# EAGLE design THREE (EAGLE 8.3.2)
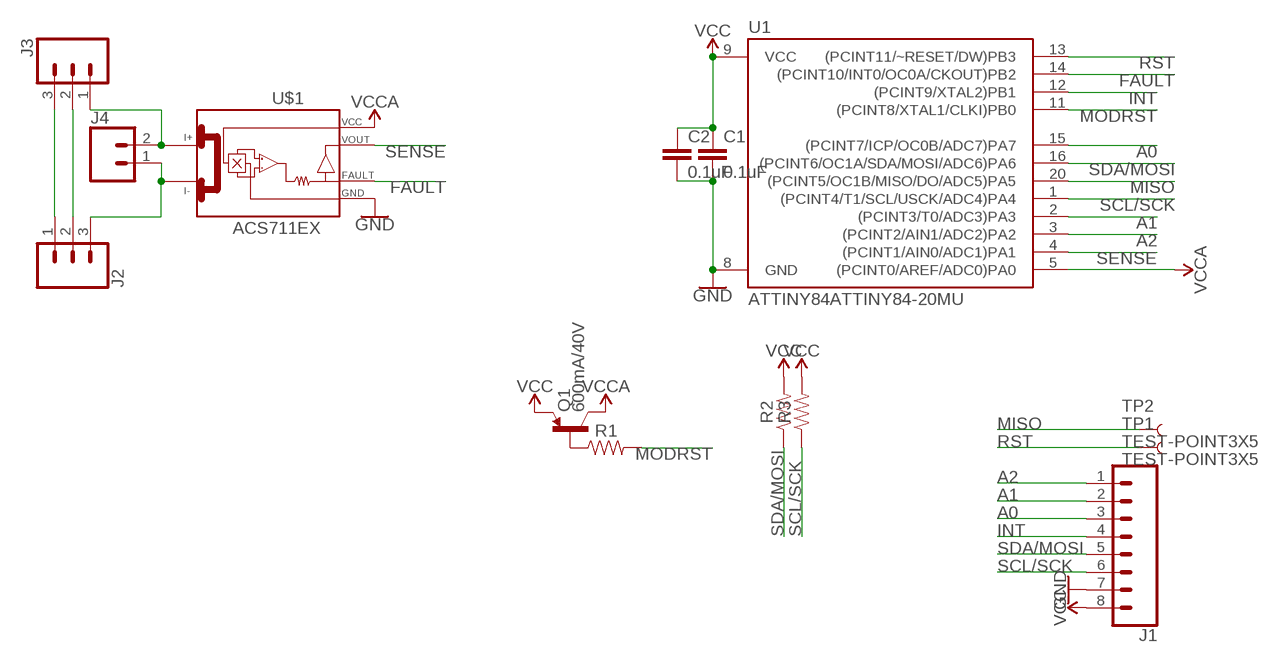
[diagram p0: schematic, sheet 1]

## Parts
C1  0.1uF  0.1UF-0603-25V-5%  [0603]
C2  0.1uF  0.1UF-0603-25V-5%  [0603]
J1  CONN_08NO_SILK_FEMALE_PTH  [1X08_NO_SILK]
J2  CONN_03-SCREW-5MM  [SCREWTERMINAL-5MM-3]
J3  CONN_03-SCREW-5MM  [SCREWTERMINAL-5MM-3]
J4  CONN_02  [1X02]
Q1  600mA/40V  TRANS_PNP-MMBT4403  [SOT23-3]
R1  RESISTOR0603  [0603]
R2  RESISTOR0603  [0603]
R3  RESISTOR0603  [0603]
TP1  TEST-POINT3X5  [PAD.03X.05]
TP2  TEST-POINT3X5  [PAD.03X.05]
U1  ATTINY84ATTINY84-20MU  [QFN20]
U$1  ACS711EX  [QFN-12EX_3X3]

## Nets
A0: J1.3 U1.15((PCINT7/ICP/OC0B/ADC7)PA7)
A1: J1.2 U1.2((PCINT3/T0/ADC3)PA3)
A2: J1.1 U1.3((PCINT2/AIN1/ADC2)PA2)
FAULT: U1.14((PCINT10/INT0/OC0A/CKOUT)PB2) U$1.P$4(FAULT)
GND: C1.2 C2.2 J1.7 U1.8(GND) U$1.P$3(GND)
INT: J1.4 U1.12((PCINT9/XTAL2)PB1)
MISO: TP2.P$1 U1.20((PCINT5/OC1B/MISO/DO/ADC5)PA5)
MODRST: R1.2 U1.11((PCINT8/XTAL1/CLKI)PB0)
N$1: J2.3 J4.1 U$1.P$2(I-_1)
N$2: J3.1 J4.2 U$1.P$1(I+_1)
N$3: J2.2 J3.2
N$4: Q1.1(B) R1.1
N$6: J2.1 J3.3
RST: TP1.P$1 U1.13((PCINT11/~RESET/DW)PB3)
SCL/SCK: J1.6 R3.1 U1.1((PCINT4/T1/SCL/USCK/ADC4)PA4)
SDA/MOSI: J1.5 R2.1 U1.16((PCINT6/OC1A/SDA/MOSI/ADC6)PA6)
SENSE: U1.4((PCINT1/AIN0/ADC1)PA1) U$1.P$9(VOUT)
VCC: C1.1 C2.1 J1.8 Q1.2(E) R2.2 R3.2 U1.9(VCC)
VCCA: Q1.3(C) U1.5((PCINT0/AREF/ADC0)PA0) U$1.P$10(VCC)

## Library data of the parts
C1 C2 = SparkFun-Capacitors:0.1UF: 0.1µF ceramic capacitors A capacitor is a passive two-terminal electrical component used to store electrical energy temporarily in an electric field.; PROD_ID: CAP-08604
J1 = SparkFun-Connectors:CONN_08: Multi connection point. Often used as Generic Header-pin footprint for 0.1 inch spaced/style header connections On any of the 0.1 inch spaced packages, you can populate with these: Break Away Headers - Straight <https://www.sparkfun.com/products/116> (PRT-00116) Break Away Male Headers - Right Angle <https://www.sparkfun.com/products/553> (PRT-00553) Female Headers <https://www.sparkfun.com/products/115> (PRT-00115) Break Away Headers - Machine Pin <https://www.sparkfun.com/products/117> (PRT-00117) Break Away Female Headers - Swiss Machine Pin <https://www.sparkfun.com/products/743> (PRT-00743) Arduino Stackable Header - 8 Pin <https://www.sparkfun.com/products/9279> (PRT-09279) For SCREWTERMINALS and SPRING TERMINALS visit here: Screw Terimnals on SparkFun.com <https://www.sparkfun.com/search/results?term=Screw+Terminals> (5mm/3.5mm/2.54mm spacing) This device is also useful as a general connection point to wire up your design to another part of your project. Our various solder wires solder well into these plated through hole pads. Hook-Up Wire - Assortment (Stranded, 22 AWG) <https://www.sparkfun.com/products/11375> (PRT-11375) Hook-Up Wire - Assortment (Solid Core, 22 AWG) <https://www.sparkfun.com/products/11367> (PRT-11367) View the entire wire category on our website here <https://www.sparkfun.com/categories/141> Special notes: Molex polarized connector foot print use with SKU : PRT-08231 with associated crimp pins and housings. 1MM SMD Version SKU: PRT-10208 NOTES ON THE VARIANTS LOCK and LOCK_LONGPADS... This footprint was designed to help hold the alignment of a through-hole component (i.e. 6-pin header) while soldering it into place. You may notice that each hole has been shifted either up or down by 0.005 of an inch from it's more standard position (which is a perfectly straight line). This slight alteration caused the pins (the squares in the middle) to touch the edges of the holes. Because they are alternating, it causes a "brace" to hold the component in place. 0.005 has proven to be the perfect amount of "off-center" position when using our standard breakaway headers. Although looks a little odd when you look at the bare footprint, once you have a header in there, the alteration is very hard to notice. Also,if you push a header all the way into place, it is covered up entirely on the bottom side.; PROD_ID: CONN-08438
J2 J3 = SparkFun-Connectors:CONN_03: Multi connection point. Often used as Generic Header-pin footprint for 0.1 inch spaced/style header connections On any of the 0.1 inch spaced packages, you can populate with these: Break Away Headers - Straight <https://www.sparkfun.com/products/116> (PRT-00116) Break Away Male Headers - Right Angle <https://www.sparkfun.com/products/553> (PRT-00553) Female Headers <https://www.sparkfun.com/products/115> (PRT-00115) Break Away Headers - Machine Pin <https://www.sparkfun.com/products/117> (PRT-00117) Break Away Female Headers - Swiss Machine Pin <https://www.sparkfun.com/products/743> (PRT-00743) Stackable Header - 3 Pin (Female, 0.1") <https://www.sparkfun.com/products/13875> (PRT-13875) For SCREWTERMINALS and SPRING TERMINALS visit here: Screw Terimnals on SparkFun.com <https://www.sparkfun.com/search/results?term=Screw+Terminals> (5mm/3.5mm/2.54mm spacing) This device is also useful as a general connection point to wire up your design to another part of your project. Our various solder wires solder well into these plated through hole pads. Hook-Up Wire - Assortment (Stranded, 22 AWG) <https://www.sparkfun.com/products/11375> (PRT-11375) Hook-Up Wire - Assortment (Solid Core, 22 AWG) <https://www.sparkfun.com/products/11367> (PRT-11367) View the entire wire category on our website here <https://www.sparkfun.com/categories/141> Special notes: Molex polarized connector foot print use with SKU : PRT-08232 with associated crimp pins and housings.; PROD_ID: CONN-10134; SF_SKU: PRT-08433
J4 = SparkFun-Connectors:CONN_02: Multi connection point. Often used as Generic Header-pin footprint for 0.1 inch spaced/style header connections On any of the 0.1 inch spaced packages, you can populate with these: Break Away Headers - Straight <https://www.sparkfun.com/products/116> (PRT-00116) Break Away Male Headers - Right Angle <https://www.sparkfun.com/products/553> (PRT-00553) Female Headers <https://www.sparkfun.com/products/115> (PRT-00115) Break Away Headers - Machine Pin <https://www.sparkfun.com/products/117> (PRT-00117) Break Away Female Headers - Swiss Machine Pin <https://www.sparkfun.com/products/743> (PRT-00743) For SCREWTERMINALS and SPRING TERMINALS visit here: Screw Terimnals on SparkFun.com <https://www.sparkfun.com/search/results?term=Screw+Terminals> (5mm/3.5mm/2.54mm spacing) This device is also useful as a general connection point to wire up your design to another part of your project. Our various solder wires solder well into these plated through hole pads. Hook-Up Wire - Assortment (Stranded, 22 AWG) <https://www.sparkfun.com/products/11375> (PRT-11375) Hook-Up Wire - Assortment (Solid Core, 22 AWG) <https://www.sparkfun.com/products/11367> (PRT-11367) View the entire wire category on our website here <https://www.sparkfun.com/categories/141> Special notes: Molex polarized connector foot print use with: PRT-08233 with associated crimp pins and housings. 2.54_SCREWTERM for use with PRT-10571. 3.5mm Screw Terminal footprints for PRT-08084 5mm Screw Terminal footprints for use with PRT-08432
Q1 = SparkFun-DiscreteSemi:TRANS_PNP: PNP transistor Current controlled devices typically used to amplify current or used as a switch. SparkFun Products: SparkFun Serial Enabled 16x2 LCD - Red on Black <https://www.sparkfun.com/products/9068> SparkFun Logomatic <https://www.sparkfun.com/products/12772>; PROD_ID: TRANS-09245
R1-R3 = SparkFun-Resistors:RESISTOR: Generic Resistor Package
TP1 TP2 = SparkFun-Connectors:TEST-POINT: SparkFun Test Points Bare copper test points for troubleshooting or In-Circuit-Testing. These are used by our Production team for verifying production board runs using pogo-pins on test beds. SparkFun Products: SparkFun LSM9DS1 Breakout <https://www.sparkfun.com/products/13284> SparkFun PSOC <https://www.sparkfun.com/products/13714> SparkFun Load Cell Amplifier <https://www.sparkfun.com/products/13879>
U1 = SparkFun-IC-Microcontroller:ATTINY84: Atmel 14-pin 2/4/8kB flash uC Datasheet <https://cdn.sparkfun.com/datasheets/Widgets/doc8006.pdf> SparkFun Products Tiny AVR Programmer <https://www.sparkfun.com/products/11801> (PGM-11801) SparkFun Servo Trigger - Continuous Rotation <https://www.sparkfun.com/products/13872> (WIG-13872) SparkFun Servo Trigger <https://www.sparkfun.com/products/13118> (WIG-13118)
U$1 = maxorig:ACS711

## Board
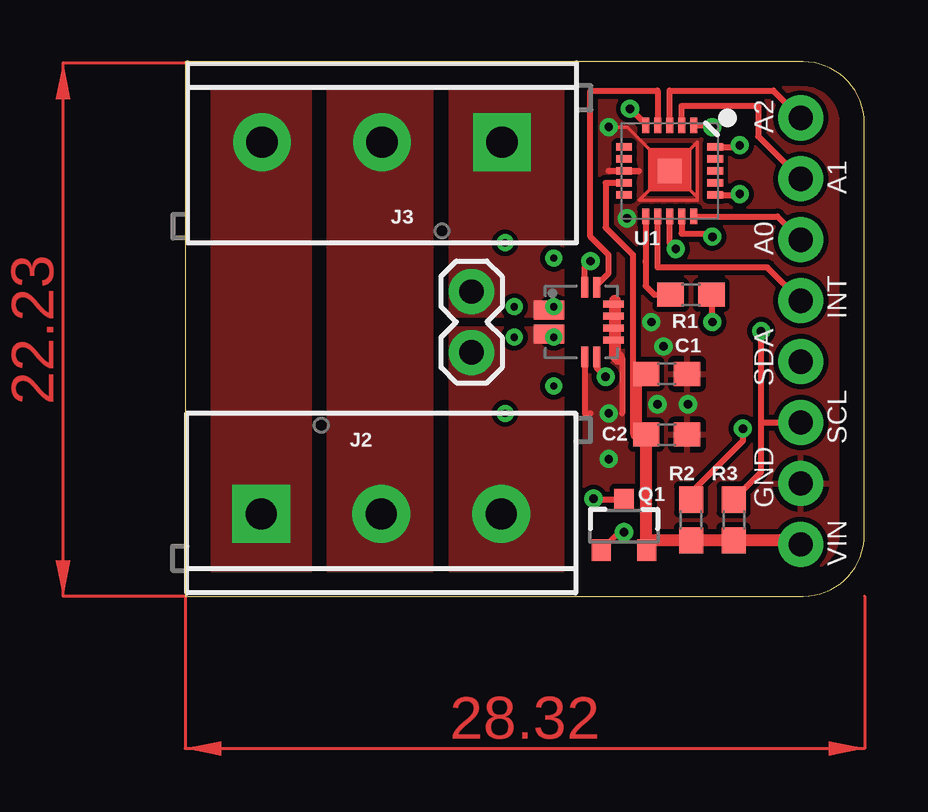
[diagram p1: board, top side]
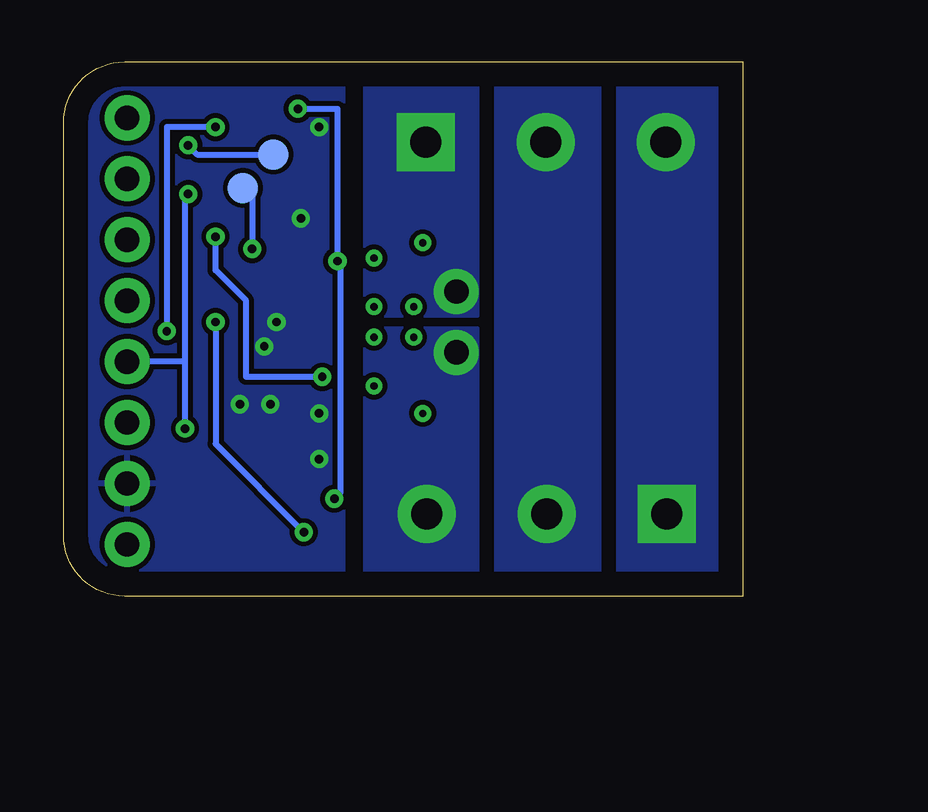
[diagram p2: board, bottom side, seen from below]

Size 28.3 x 22.28 mm. Coordinates in mm from the lower left corner, seen from the top.
Outline: 0,0 25.76,0 arc90 28.3,2.54 28.3,19.74 arc90 25.76,22.28 0,22.28 0,0
Copper layers (1*16): Top 0.035mm / dielectric 1.5mm / Bottom 0.035mm
Design rules "default": minimum track width 10mil, minimum drill 24mil, track to track 8mil, track to pad 8mil, pad to pad 8mil, via to via 8mil, smd to smd 8mil, copper to edge 40mil, drill to drill 8mil, minimum pad ring 10mil, minimum via ring 8mil, stop-mask expansion 4mil, vias tented up to drill 0mil, thermal gap 10mil

### Footprints (pad centres in the part's own frame; a part is rotated, then mirrored left to right if it is on the bottom)
0603 = smd 1.1 x 1: 1 -0.85,0; 2 0.85,0
1X08_NO_SILK = drill 1.016 pad 1.88: 1 0,0; 2 2.54,0; 3 5.08,0; 4 7.62,0; 5 10.16,0; 6 12.7,0; 7 15.24,0; 8 17.78,0
SCREWTERMINAL-5MM-3 = drill 1.3 pad 2.413 square: 1 0,0 | drill 1.3 pad 2.413: 2 5,0; 3 10,0
1X02 = drill 1.016 pad 1.88: 1 0,0; 2 2.54,0
SOT23-3 = smd 0.8 x 0.9: 1 -0.95,-1; 2 0.95,-1; 3 0,1.1
PAD.03X.05 = smd 1.27 x 1.27: P$1 0,0
QFN20 = smd 1 x 1: 0 0,0 | smd 0.65 x 0.3: 1 -1.9,1; 2 -1.9,0.5; 3 -1.9,0; 4 -1.9,-0.5; 5 -1.9,-1; 11 1.9,-1; 12 1.9,-0.5; 13 1.9,0; 14 1.9,0.5; 15 1.9,1 | smd 0.3 x 0.65: 6 -1,-1.9; 7 -0.5,-1.9; 8 0,-1.9; 9 0.5,-1.9; 10 1,-1.9; 16 1,1.9; 17 0.5,1.9; 18 0,1.9; 19 -0.5,1.9; 20 -1,1.9
QFN-12EX_3X3 = smd 1.27 x 0.8: P$1 -1.35,0.5; P$2 -1.35,-0.5 | smd 0.3 x 0.85: P$3 0.15,-1.45; P$4 0.65,-1.45; P$9 0.65,1.45; P$10 0.15,1.45 | smd 0.85 x 0.3: P$5 1.35,-0.75; P$6 1.35,-0.25; P$7 1.35,0.25; P$8 1.35,0.75

### Placement (x,y rotation side)
C1  20.07,9.27 0 top
C2  20.07,6.73 0 top
J1  25.65,19.94 270 top
J2  3.17,3.43 0 top
J3  13.21,18.92 180 top
J4  11.94,10.16 90 top
Q1  18.29,2.92 0 top
R1  21.08,12.57 180 top
R2  21.08,3.17 270 top
R3  22.86,3.17 270 top
TP1  20.83,17.02 0 bottom
TP2  19.56,18.41 0 bottom
U1  20.19,17.73 270 top
U$1  16.51,11.43 0 top

### Tracks (layer width: path | path; a pad name or v marks a point on that pad's centre or on a via)
A0
  Top 0.254: U1.15 24.69,15.83 J1.3
A1
  Top 0.254: U1.2 20.69,20.45 23.88,20.45 23.88,19.18 J1.2
A2
  Top 0.254: U1.3 20.19,21.08 24.51,21.08 J1.1
FAULT  (via drill 0.35)
  Top 0.254: 17.16,9.65 U$1.P$4 17.16,9.51 v17.53,9.14 | U1.14 20.69,15.12 20.7,15.11 21.84,15.11 v21.97,14.99
  Bottom 0.254: v21.97,14.99 21.97,13.59 20.7,12.32 20.7,9.14 v17.53,9.14
GND  (via drill 0.35)
  Top 0.152: v17.65,19.56 18.41,19.56 21.34,16.64 | 21.34,16.64 21.34,17.65 21.34,18.92 18.92,16.51 21.34,16.51 21.34,16.64
  Top 0.254: 17.91,10.03 17.91,10.16 arc-90 18.21,9.91 18.21,7.62 | U$1.P$3 16.66,7.62 16.89,7.62 | 17.65,17.73 18.92,17.73 U1.8
  Top 0.508: 17.91,12.32 17.91,10.16 | 17.91,10.03 18.03,9.91
  other vias: 18.41,15.75 19.43,11.43 19.94,10.41 19.68,8 20.95,8 17.65,7.62 17.65,5.71
  pour Bottom: 16.64,22.1 27.94,22.1 27.94,0.76 16.64,0.76
  pour Top: 16.64,22.1 27.94,22.1 27.94,0.76 16.64,0.76
INT
  Top 0.254: U1.12 19.69,13.71 24.27,13.71 J1.4
MISO  (via drill 0.35)
  Top 0.254: U1.20 23.11,18.73 v23.11,18.8
  Bottom 0.254: v23.11,18.8 22.73,18.41 TP2.P$1
MODRST
  Top 0.254: U1.11 19.19,13.97 19.19,13.91 19.19,12.94 19.56,12.57 R1.2
N$1
  pour Bottom (no thermals): 15.75,11.18 11.05,11.18 11.05,0.13 15.75,0.13
  pour Top (no thermals): 15.37,11.18 11.05,11.18 11.05,0.13 15.75,0.13 15.75,11.18
N$2
  pour Bottom (no thermals): 15.75,11.68 15.75,22.1 11.05,22.1 11.05,11.68
  pour Top (no thermals): 15.75,22.1 15.75,11.68 11.05,11.68 11.05,22.1
N$3
  pour Bottom (no thermals): 10.29,0.13 10.29,22.1 5.97,22.1 5.97,0.13
  pour Top (no thermals): 10.29,22.1 10.29,0.13 5.97,0.13 5.97,22.1
N$4  (via drill 0.35)
  Top 0.254: 17.34,1.97 Q1.1 18.08,2.67 v18.29,2.67 | v21.97,11.43 21.97,12.53 R1.1
  Bottom 0.254: v18.29,2.67 21.97,6.35 v21.97,11.43
N$5
  cutout Top: 16.51,12.83 17.91,12.83 17.91,9.91 16.51,9.91
N$6
  pour Bottom (no thermals): 5.21,0.13 5.21,22.1 0.89,22.1 0.89,0.13
  pour Top (no thermals): 5.21,22.1 5.21,0.13 0.89,0.13 0.89,22.1
N$7  (via drill 0.3)
  other vias: 15.37,10.79
N$8  (via drill 0.3)
  other vias: 13.72,10.79
N$9  (via drill 0.3)
  other vias: 13.72,12.06
N$10  (via drill 0.3)
  other vias: 15.37,12.06
N$11  (via drill 0.3)
  other vias: 15.37,14.1
N$12  (via drill 0.3)
  other vias: 15.37,8.76
N$13  (via drill 0.3)
  other vias: 13.34,7.62
N$14  (via drill 0.3)
  other vias: 13.34,14.73
RST  (via drill 0.35)
  Top 0.254: v20.45,14.48 20.19,14.73 U1.13
  Bottom 0.254: TP1.P$1 20.45,16.64 v20.45,14.48
SCL/SCK  (via drill 0.35)
  Top 0.254: U1.1 21.9,19.63 v21.97,19.56 | 24,7.24 v24,11.05 | 24,7.24 J1.6 | R3.1 24,5.17 24,7.24
  Bottom 0.254: v21.97,19.56 24,19.56 v24,11.05
SDA/MOSI  (via drill 0.35)
  Top 0.254: U1.16 23.11,16.73 v23.11,16.76 | v23.24,6.99 23.24,6.48 21.08,4.32 R2.1
  Bottom 0.254: v23.11,16.76 23.24,16.76 23.24,9.78 | 23.24,9.78 J1.5 | v23.24,6.99 23.24,9.78
SENSE
  Top 0.254: U$1.P$9 17.16,12.97 17.65,13.46 17.65,14.22 16.89,14.99 16.89,21.08 19.69,21.08 U1.4
VCC
  Top 0.254: U1.9 17.53,17.23 17.53,15.37 18.67,14.22 18.67,8.7 18.81,8.84 18.86,8.89 C1.1 | 19.24,2.09 Q1.2 19.3,1.99
  Top 0.508: J1.8 25.49,2.33 R3.2 R2.2 19.22,2.33 | 18.81,8.84 18.81,6.73 C2.1 19.22,2.33 | 19.22,2.33 19.22,1.94 Q1.2
VCCA  (via drill 0.35)
  Top 0.254: U$1.P$10 16.66,13.74 v16.89,13.97 | U1.5 19.19,19.67 v18.54,20.32 | Q1.3 17.06,4.02 v17.02,4.06
  Bottom 0.254: v18.54,20.32 16.89,20.32 v16.89,13.97 16.76,13.84 16.76,4.32 v17.02,4.06
(copper drawn outside any net)
  shapes: Top area x3

### Text on the board
tPlace: A2 | A1 | A0 | INT | SDA | SCL | GND | VIN